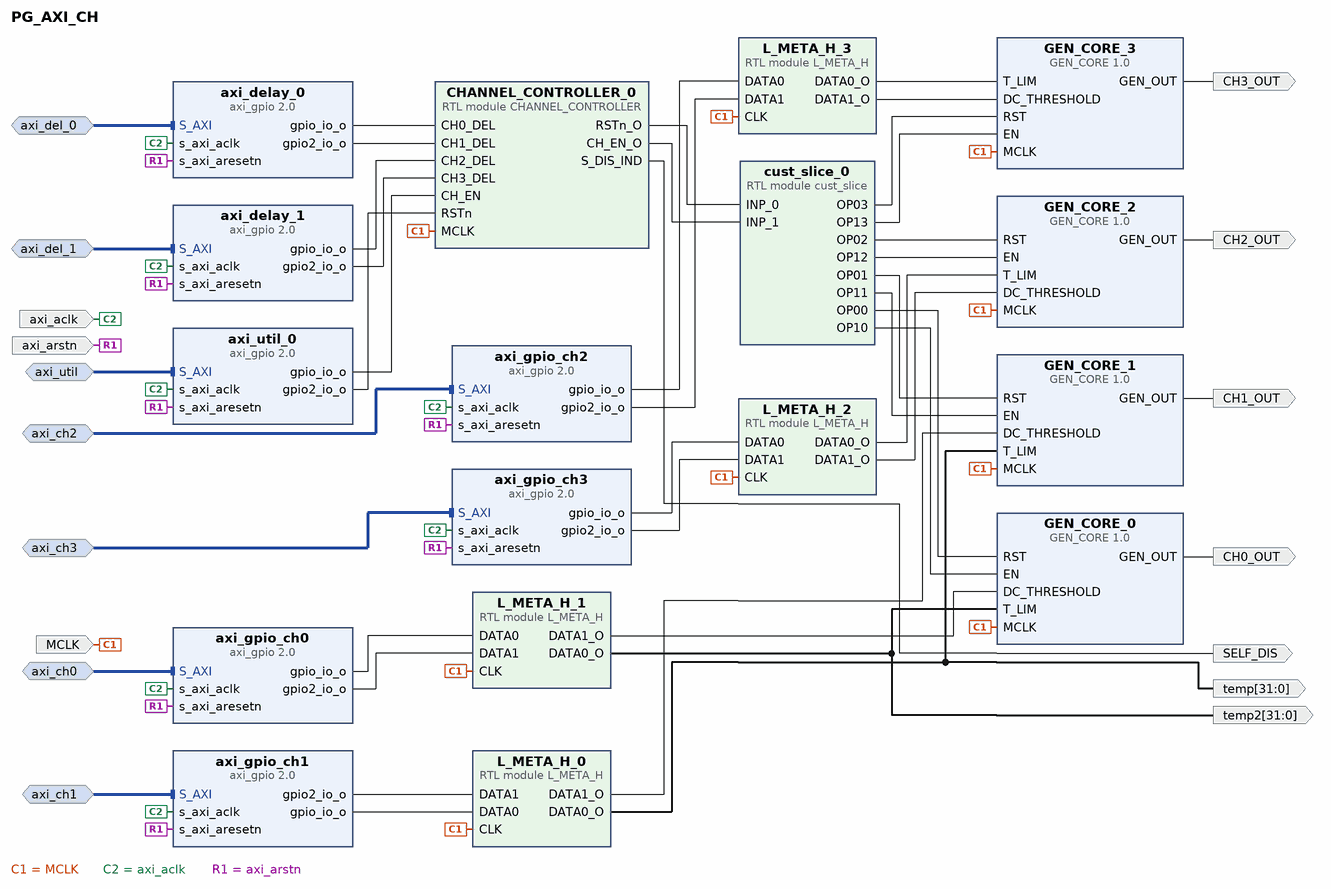
[diagram p0: block diagram of the top level]
# Vivado block design PG_AXI_CH, xc7z020clg400-1, Vivado 2019.1
create_bd_design PG_AXI_CH

create_bd_intf_port -mode Slave -vlnv xilinx.com:interface:aximm_tlm:1.0 axi_ch0
create_bd_intf_port -mode Slave -vlnv xilinx.com:interface:aximm_tlm:1.0 axi_ch1
create_bd_intf_port -mode Slave -vlnv xilinx.com:interface:aximm_tlm:1.0 axi_ch2
create_bd_intf_port -mode Slave -vlnv xilinx.com:interface:aximm_tlm:1.0 axi_ch3
create_bd_intf_port -mode Slave -vlnv xilinx.com:interface:aximm_tlm:1.0 axi_del_0
create_bd_intf_port -mode Slave -vlnv xilinx.com:interface:aximm_tlm:1.0 axi_del_1
create_bd_intf_port -mode Slave -vlnv xilinx.com:interface:aximm_tlm:1.0 axi_util
create_bd_port -dir I MCLK
create_bd_port -dir O SELF_DIS
create_bd_port -dir O CH0_OUT
create_bd_port -dir O CH1_OUT
create_bd_port -dir O CH2_OUT
create_bd_port -dir O CH3_OUT
create_bd_port -dir I axi_aclk
create_bd_port -dir I axi_arstn
create_bd_port -dir O -from 31 -to 0 temp
create_bd_port -dir O -from 31 -to 0 temp2

create_bd_cell -type ip -vlnv cri.nz:user:GEN_CORE:1.0 GEN_CORE_0
create_bd_cell -type ip -vlnv cri.nz:user:GEN_CORE:1.0 GEN_CORE_1
create_bd_cell -type ip -vlnv cri.nz:user:GEN_CORE:1.0 GEN_CORE_2
create_bd_cell -type ip -vlnv cri.nz:user:GEN_CORE:1.0 GEN_CORE_3
create_bd_cell -type module -reference cust_slice cust_slice_0
create_bd_cell -type ip -vlnv xilinx.com:ip:axi_gpio:2.0 axi_gpio_ch0
set_property -dict {CONFIG.C_ALL_OUTPUTS 1 CONFIG.C_ALL_OUTPUTS_2 1 CONFIG.C_IS_DUAL 1} [get_bd_cells axi_gpio_ch0]
create_bd_cell -type ip -vlnv xilinx.com:ip:axi_gpio:2.0 axi_gpio_ch1
set_property -dict {CONFIG.C_ALL_OUTPUTS 1 CONFIG.C_ALL_OUTPUTS_2 1 CONFIG.C_IS_DUAL 1} [get_bd_cells axi_gpio_ch1]
create_bd_cell -type ip -vlnv xilinx.com:ip:axi_gpio:2.0 axi_gpio_ch2
set_property -dict {CONFIG.C_ALL_OUTPUTS 1 CONFIG.C_ALL_OUTPUTS_2 1 CONFIG.C_IS_DUAL 1} [get_bd_cells axi_gpio_ch2]
create_bd_cell -type ip -vlnv xilinx.com:ip:axi_gpio:2.0 axi_gpio_ch3
set_property -dict {CONFIG.C_ALL_OUTPUTS 1 CONFIG.C_ALL_OUTPUTS_2 1 CONFIG.C_IS_DUAL 1} [get_bd_cells axi_gpio_ch3]
create_bd_cell -type ip -vlnv xilinx.com:ip:axi_gpio:2.0 axi_delay_0
set_property -dict {CONFIG.C_ALL_OUTPUTS 1 CONFIG.C_ALL_OUTPUTS_2 1 CONFIG.C_IS_DUAL 1} [get_bd_cells axi_delay_0]
create_bd_cell -type ip -vlnv xilinx.com:ip:axi_gpio:2.0 axi_delay_1
set_property -dict {CONFIG.C_ALL_OUTPUTS 1 CONFIG.C_ALL_OUTPUTS_2 1 CONFIG.C_IS_DUAL 1} [get_bd_cells axi_delay_1]
create_bd_cell -type ip -vlnv xilinx.com:ip:axi_gpio:2.0 axi_util_0
set_property -dict [list \
  CONFIG.C_ALL_OUTPUTS 1 \
  CONFIG.C_ALL_OUTPUTS_2 1 \
  CONFIG.C_GPIO2_WIDTH 1 \
  CONFIG.C_GPIO_WIDTH 4 \
  CONFIG.C_IS_DUAL 1 \
] [get_bd_cells axi_util_0]
create_bd_cell -type module -reference L_META_H L_META_H_0
create_bd_cell -type module -reference L_META_H L_META_H_1
create_bd_cell -type module -reference L_META_H L_META_H_2
create_bd_cell -type module -reference L_META_H L_META_H_3
create_bd_cell -type module -reference CHANNEL_CONTROLLER CHANNEL_CONTROLLER_0

# ---- connections ----

connect_bd_intf_net [get_bd_intf_ports axi_util] [get_bd_intf_pins axi_util_0/S_AXI]
connect_bd_intf_net -intf_net axi_del_1_1 [get_bd_intf_ports axi_del_1] [get_bd_intf_pins axi_delay_1/S_AXI]
connect_bd_intf_net -intf_net axi_ch2_1 [get_bd_intf_ports axi_ch2] [get_bd_intf_pins axi_gpio_ch2/S_AXI]
connect_bd_intf_net -intf_net axi_ch1_1 [get_bd_intf_ports axi_ch1] [get_bd_intf_pins axi_gpio_ch1/S_AXI]
connect_bd_intf_net -intf_net axi_ch3_1 [get_bd_intf_ports axi_ch3] [get_bd_intf_pins axi_gpio_ch3/S_AXI]
connect_bd_intf_net -intf_net axi_ch0_1 [get_bd_intf_ports axi_ch0] [get_bd_intf_pins axi_gpio_ch0/S_AXI]
connect_bd_intf_net -intf_net axi_del_0_1 [get_bd_intf_ports axi_del_0] [get_bd_intf_pins axi_delay_0/S_AXI]
connect_bd_net [get_bd_pins CHANNEL_CONTROLLER_0/RSTn_O] [get_bd_pins cust_slice_0/INP_0]
connect_bd_net [get_bd_pins CHANNEL_CONTROLLER_0/CH_EN_O] [get_bd_pins cust_slice_0/INP_1]
connect_bd_net [get_bd_pins cust_slice_0/OP00] [get_bd_pins GEN_CORE_0/RST]
connect_bd_net [get_bd_pins cust_slice_0/OP01] [get_bd_pins GEN_CORE_1/RST]
connect_bd_net [get_bd_pins cust_slice_0/OP02] [get_bd_pins GEN_CORE_2/RST]
connect_bd_net [get_bd_pins cust_slice_0/OP03] [get_bd_pins GEN_CORE_3/RST]
connect_bd_net [get_bd_pins cust_slice_0/OP10] [get_bd_pins GEN_CORE_0/EN]
connect_bd_net [get_bd_pins cust_slice_0/OP11] [get_bd_pins GEN_CORE_1/EN]
connect_bd_net [get_bd_pins cust_slice_0/OP12] [get_bd_pins GEN_CORE_2/EN]
connect_bd_net [get_bd_pins cust_slice_0/OP13] [get_bd_pins GEN_CORE_3/EN]
connect_bd_net [get_bd_pins CHANNEL_CONTROLLER_0/S_DIS_IND] [get_bd_ports SELF_DIS]
connect_bd_net [get_bd_pins GEN_CORE_0/GEN_OUT] [get_bd_ports CH0_OUT]
connect_bd_net [get_bd_pins GEN_CORE_1/GEN_OUT] [get_bd_ports CH1_OUT]
connect_bd_net [get_bd_pins GEN_CORE_2/GEN_OUT] [get_bd_ports CH2_OUT]
connect_bd_net [get_bd_pins GEN_CORE_3/GEN_OUT] [get_bd_ports CH3_OUT]
connect_bd_net [get_bd_ports MCLK] \
  [get_bd_pins GEN_CORE_0/MCLK] [get_bd_pins GEN_CORE_1/MCLK] [get_bd_pins GEN_CORE_2/MCLK] [get_bd_pins GEN_CORE_3/MCLK] \
  [get_bd_pins L_META_H_0/CLK] [get_bd_pins L_META_H_1/CLK] [get_bd_pins L_META_H_2/CLK] [get_bd_pins L_META_H_3/CLK] \
  [get_bd_pins CHANNEL_CONTROLLER_0/MCLK]
connect_bd_net [get_bd_pins axi_delay_0/gpio_io_o] [get_bd_pins CHANNEL_CONTROLLER_0/CH0_DEL]
connect_bd_net [get_bd_pins axi_delay_0/gpio2_io_o] [get_bd_pins CHANNEL_CONTROLLER_0/CH1_DEL]
connect_bd_net [get_bd_pins axi_delay_1/gpio_io_o] [get_bd_pins CHANNEL_CONTROLLER_0/CH2_DEL]
connect_bd_net [get_bd_pins axi_delay_1/gpio2_io_o] [get_bd_pins CHANNEL_CONTROLLER_0/CH3_DEL]
connect_bd_net [get_bd_pins axi_util_0/gpio_io_o] [get_bd_pins CHANNEL_CONTROLLER_0/CH_EN]
connect_bd_net [get_bd_pins axi_util_0/gpio2_io_o] [get_bd_pins CHANNEL_CONTROLLER_0/RSTn]
connect_bd_net [get_bd_ports axi_aclk] \
  [get_bd_pins axi_gpio_ch0/s_axi_aclk] [get_bd_pins axi_gpio_ch1/s_axi_aclk] [get_bd_pins axi_gpio_ch2/s_axi_aclk] \
  [get_bd_pins axi_gpio_ch3/s_axi_aclk] [get_bd_pins axi_delay_0/s_axi_aclk] [get_bd_pins axi_delay_1/s_axi_aclk] \
  [get_bd_pins axi_util_0/s_axi_aclk]
connect_bd_net [get_bd_ports axi_arstn] \
  [get_bd_pins axi_gpio_ch3/s_axi_aresetn] [get_bd_pins axi_gpio_ch2/s_axi_aresetn] [get_bd_pins axi_gpio_ch1/s_axi_aresetn] \
  [get_bd_pins axi_gpio_ch0/s_axi_aresetn] [get_bd_pins axi_delay_0/s_axi_aresetn] [get_bd_pins axi_delay_1/s_axi_aresetn] \
  [get_bd_pins axi_util_0/s_axi_aresetn]
connect_bd_net [get_bd_pins L_META_H_0/DATA0_O] [get_bd_pins GEN_CORE_1/T_LIM] [get_bd_ports temp]
connect_bd_net [get_bd_pins L_META_H_0/DATA1_O] [get_bd_pins GEN_CORE_1/DC_THRESHOLD]
connect_bd_net [get_bd_pins axi_gpio_ch1/gpio2_io_o] [get_bd_pins L_META_H_0/DATA1]
connect_bd_net [get_bd_pins axi_gpio_ch1/gpio_io_o] [get_bd_pins L_META_H_0/DATA0]
connect_bd_net [get_bd_pins axi_gpio_ch0/gpio_io_o] [get_bd_pins L_META_H_1/DATA0]
connect_bd_net [get_bd_pins axi_gpio_ch0/gpio2_io_o] [get_bd_pins L_META_H_1/DATA1]
connect_bd_net [get_bd_pins L_META_H_1/DATA0_O] [get_bd_pins GEN_CORE_0/T_LIM] [get_bd_ports temp2]
connect_bd_net [get_bd_pins L_META_H_1/DATA1_O] [get_bd_pins GEN_CORE_0/DC_THRESHOLD]
connect_bd_net [get_bd_pins axi_gpio_ch3/gpio_io_o] [get_bd_pins L_META_H_2/DATA0]
connect_bd_net [get_bd_pins axi_gpio_ch3/gpio2_io_o] [get_bd_pins L_META_H_2/DATA1]
connect_bd_net [get_bd_pins L_META_H_2/DATA0_O] [get_bd_pins GEN_CORE_2/T_LIM]
connect_bd_net [get_bd_pins L_META_H_2/DATA1_O] [get_bd_pins GEN_CORE_2/DC_THRESHOLD]
connect_bd_net [get_bd_pins axi_gpio_ch2/gpio_io_o] [get_bd_pins L_META_H_3/DATA0]
connect_bd_net [get_bd_pins axi_gpio_ch2/gpio2_io_o] [get_bd_pins L_META_H_3/DATA1]
connect_bd_net [get_bd_pins L_META_H_3/DATA0_O] [get_bd_pins GEN_CORE_3/T_LIM]
connect_bd_net [get_bd_pins L_META_H_3/DATA1_O] [get_bd_pins GEN_CORE_3/DC_THRESHOLD]

validate_bd_design
save_bd_design
